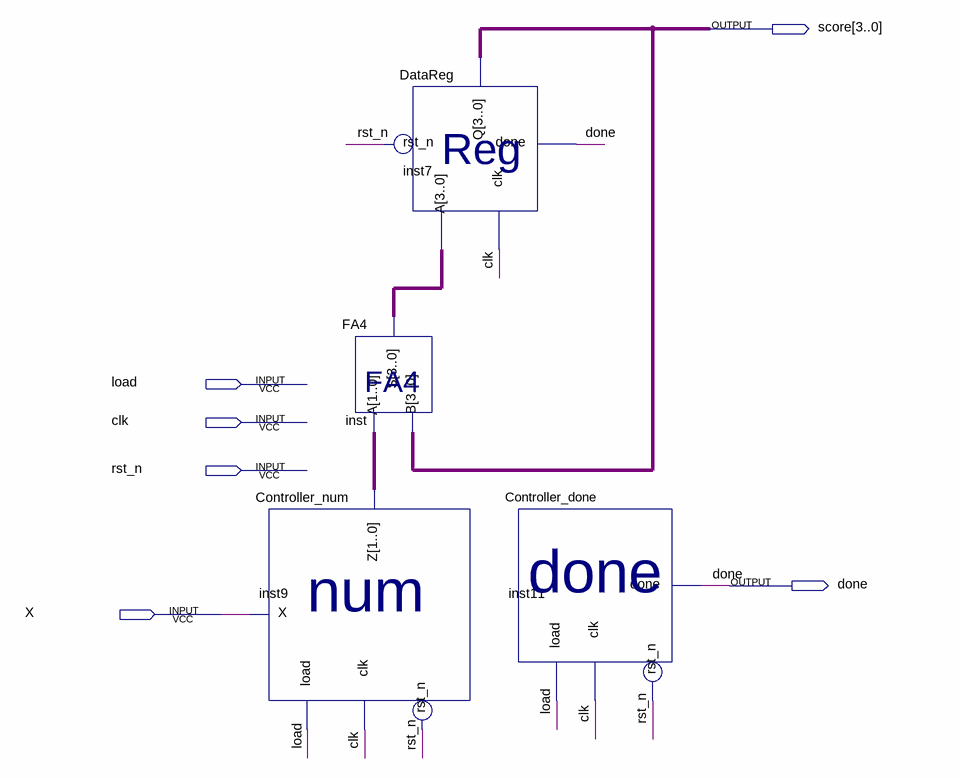
[diagram p0: schematic sheet]
// Quartus schematic WSC.bdf as structural Verilog: 4 symbols, 6 pins
module WSC (
  input  load,
  input  clk,
  input  rst_n,
  input  X,
  output [3:0] score,
  output done
);

  wire [1:0] inst9_z;
  wire [3:0] inst_s;

  Controller_num inst9 (.rst_n(rst_n), .clk(clk), .X(X), .load(load), .Z(inst9_z));
  FA4 inst (.B(score), .A(inst9_z), .S(inst_s));
  DataReg inst7 (.A(inst_s), .clk(clk), .rst_n(rst_n), .done(done), .Q(score));
  Controller_done inst11 (.rst_n(rst_n), .load(load), .clk(clk), .done(done));
endmodule
